# Altium schematic sheet NFC.SchDoc
size A4; SheetNumber: 7; SheetTotal: 7
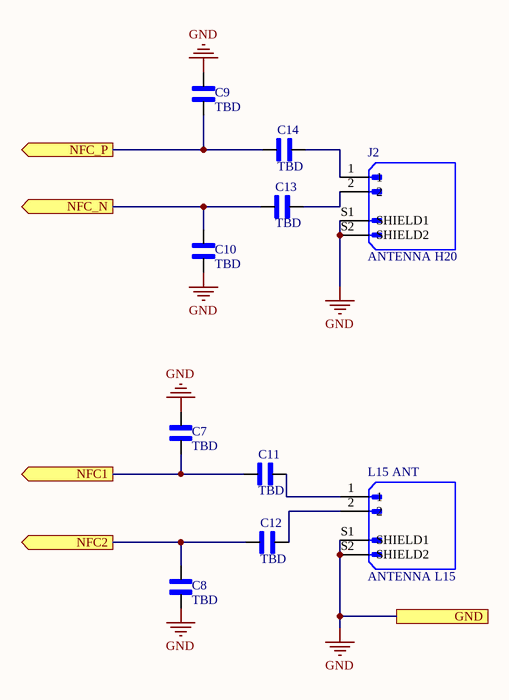
[diagram p0: NFC.SchDoc]

## Parts
C7  TBD  [CAPC2012X88N]
C8  TBD  [CAPC2012X88N]
C9  TBD  [CAPC2012X88N]
C10  TBD  [CAPC2012X88N]
C11  TBD  [CAPC2012X88N]
C12  TBD  [CAPC2012X88N]
C13  TBD  [CAPC2012X88N]
C14  TBD  [CAPC2012X88N]
J2  ANTENNA H20  [MOLEX_532610271]
L15_ANT  ANTENNA L15  [MOLEX_532610271]

## Ports
GND (see TOP_LEVEL[1D], FLASH[3C], MODULES[2D], POWER_IN[3C], SWD[2B], USB[2C]), NFC1 (out, see TOP_LEVEL[1C], MODULES[3D]), NFC2 (out, see TOP_LEVEL[1D], MODULES[3D]), NFC_N (out, see TOP_LEVEL[1C], MODULES[3B]), NFC_P (out, see TOP_LEVEL[1C], MODULES[4B])

## Nets
GND: C7.1 C8.2 C9.1 C10.2 J2.S1(SHIELD1) J2.S2(SHIELD2) L15_ANT.S1(SHIELD1) L15_ANT.S2(SHIELD2) ; port GND
NFC1: C7.2 C11.2 ; port NFC1
NFC2: C8.1 C12.2 ; port NFC2
NFC_N: C10.1 C13.2 ; port NFC_N
NFC_P: C9.2 C14.2 ; port NFC_P
NetC11_1: C11.1 L15_ANT.1
NetC12_1: C12.1 L15_ANT.2
NetC13_1: C13.1 J2.2
NetC14_1: C14.1 J2.1

## Library data of the parts
C7-C14 = C0805C473K1RACTU: 0805 C0G/NP0 ceramic capacitor for nfc fix; MF: KEMET; SnapEDA_Link: https://www.snapeda.com/parts/C0805C473K1RACTU/KEMET/view-part/?ref=snap; Package: 805-2 KEMET; Value: *; MP: C0805C473K1RACTU; Check_prices: https://www.snapeda.com/parts/C0805C473K1RACTU/KEMET/view-part/?ref=eda
J2 L15_ANT = 532610271: Connector Header Surface Mount, Right Angle 2 position 0.049 (1.25mm); MF: Molex; Purchase-URL: https://pricing.snapeda.com/search/part/532610271/?ref=eda; Value: *; MP: 532610271; Package: None; Check_prices: https://www.snapeda.com/parts/532610271/Molex/view-part/?ref=eda; Price: None; Availability: In Stock; SnapEDA_Link: https://www.snapeda.com/parts/532610271/Molex/view-part/?ref=snap